# Altium schematic sheet Sheet6.SchDoc
size A2; PageSetup: Record=PageOptions|CenterHorizontal=True|CenterVertical=True|PrintScale=0.50|XCorrection=1.00|YCorrection=1.00|PrintKind=2|BorderSize=5000000|LeftOffset=0|BottomOffset=0|Orientation=2|PaperLength=1000|PaperWidth=1000|Scale=100|PaperSource=7|PrintQuality=-4|MediaType=1|DitherType=10|PaperKind=A4|PrintScaleMode=1
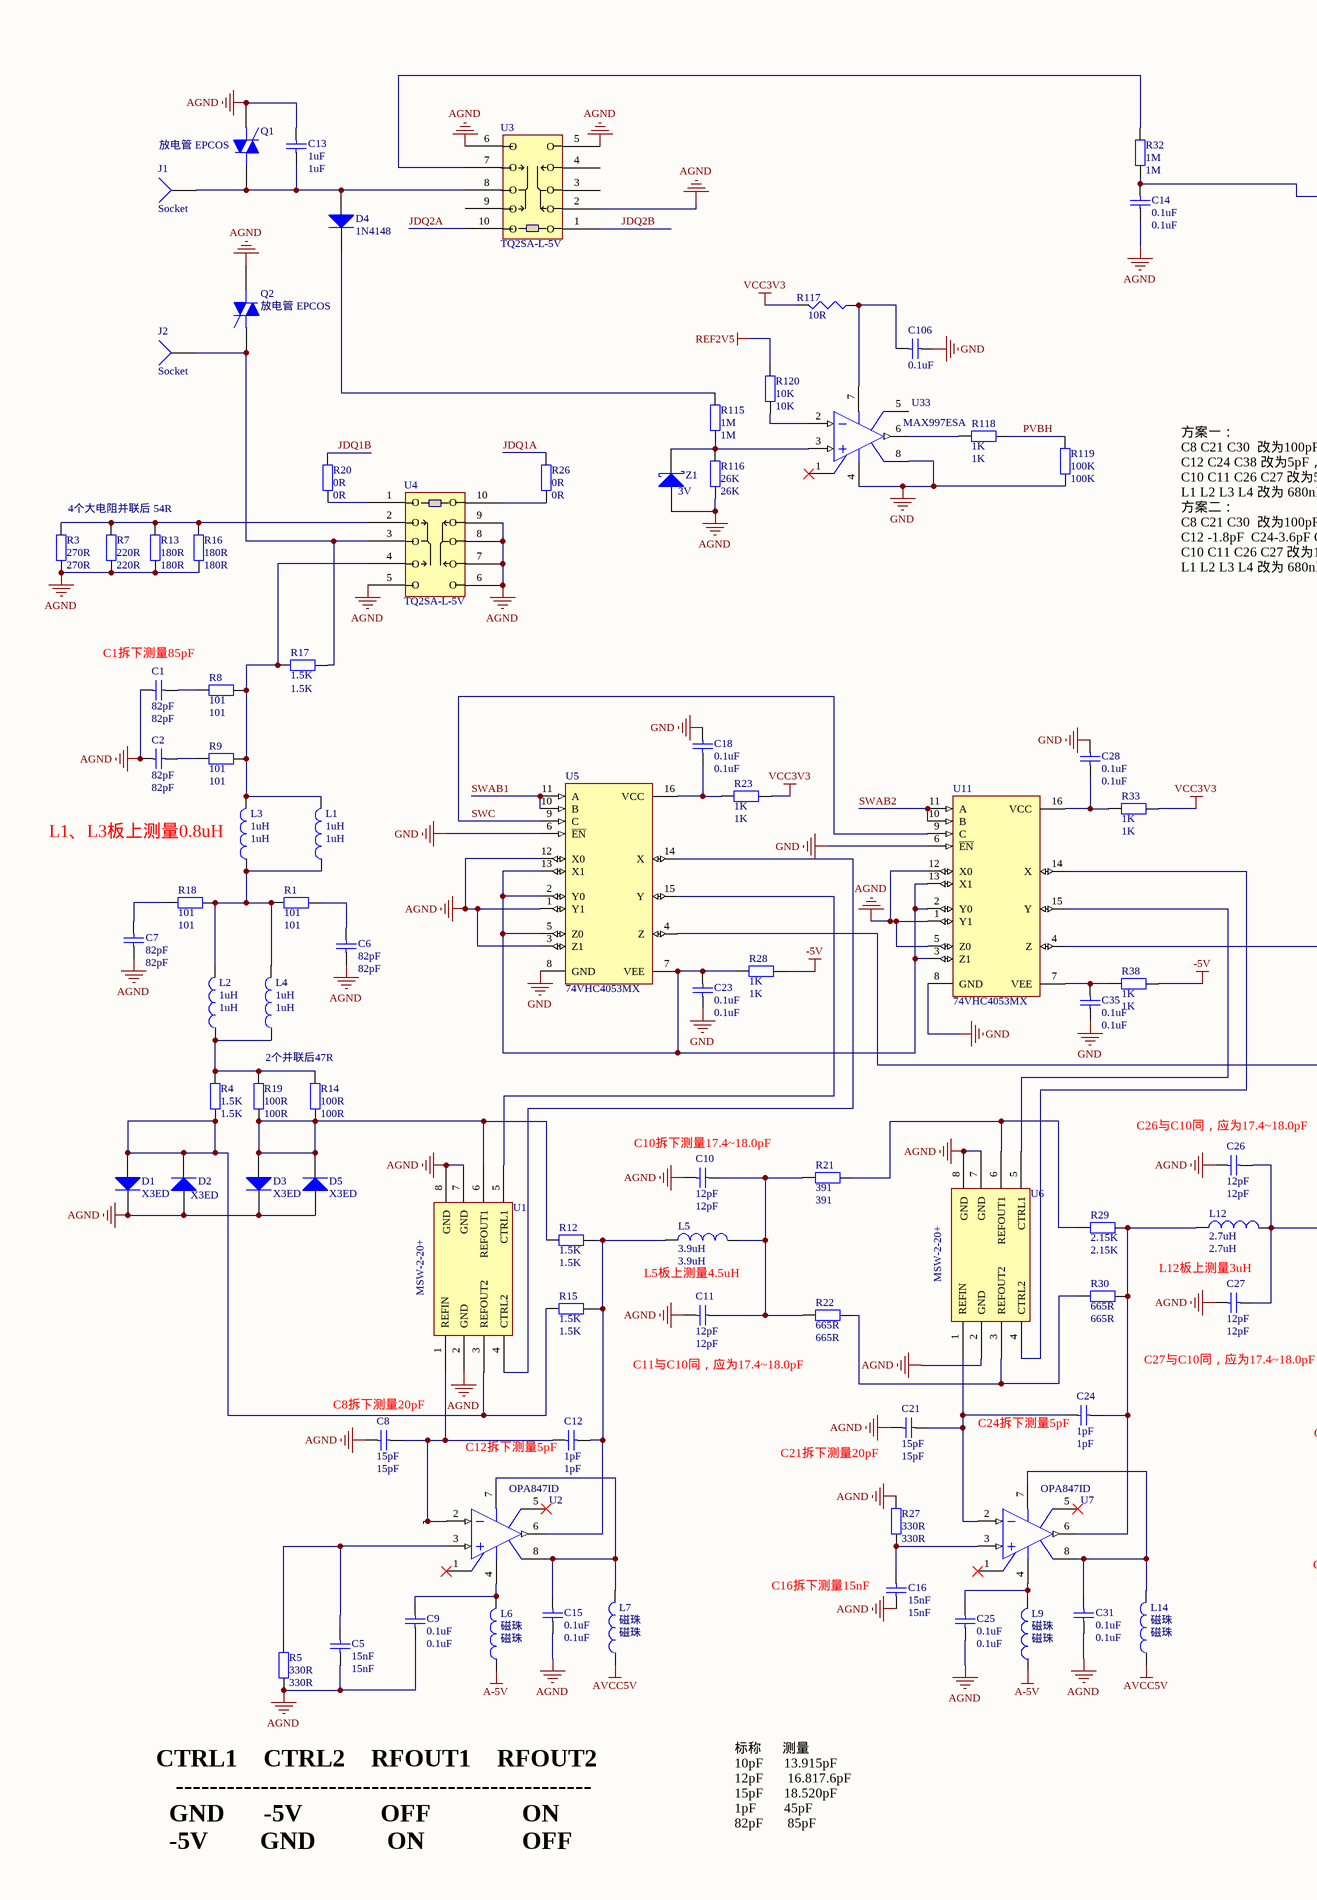
[diagram p0: Sheet6.SchDoc, left]
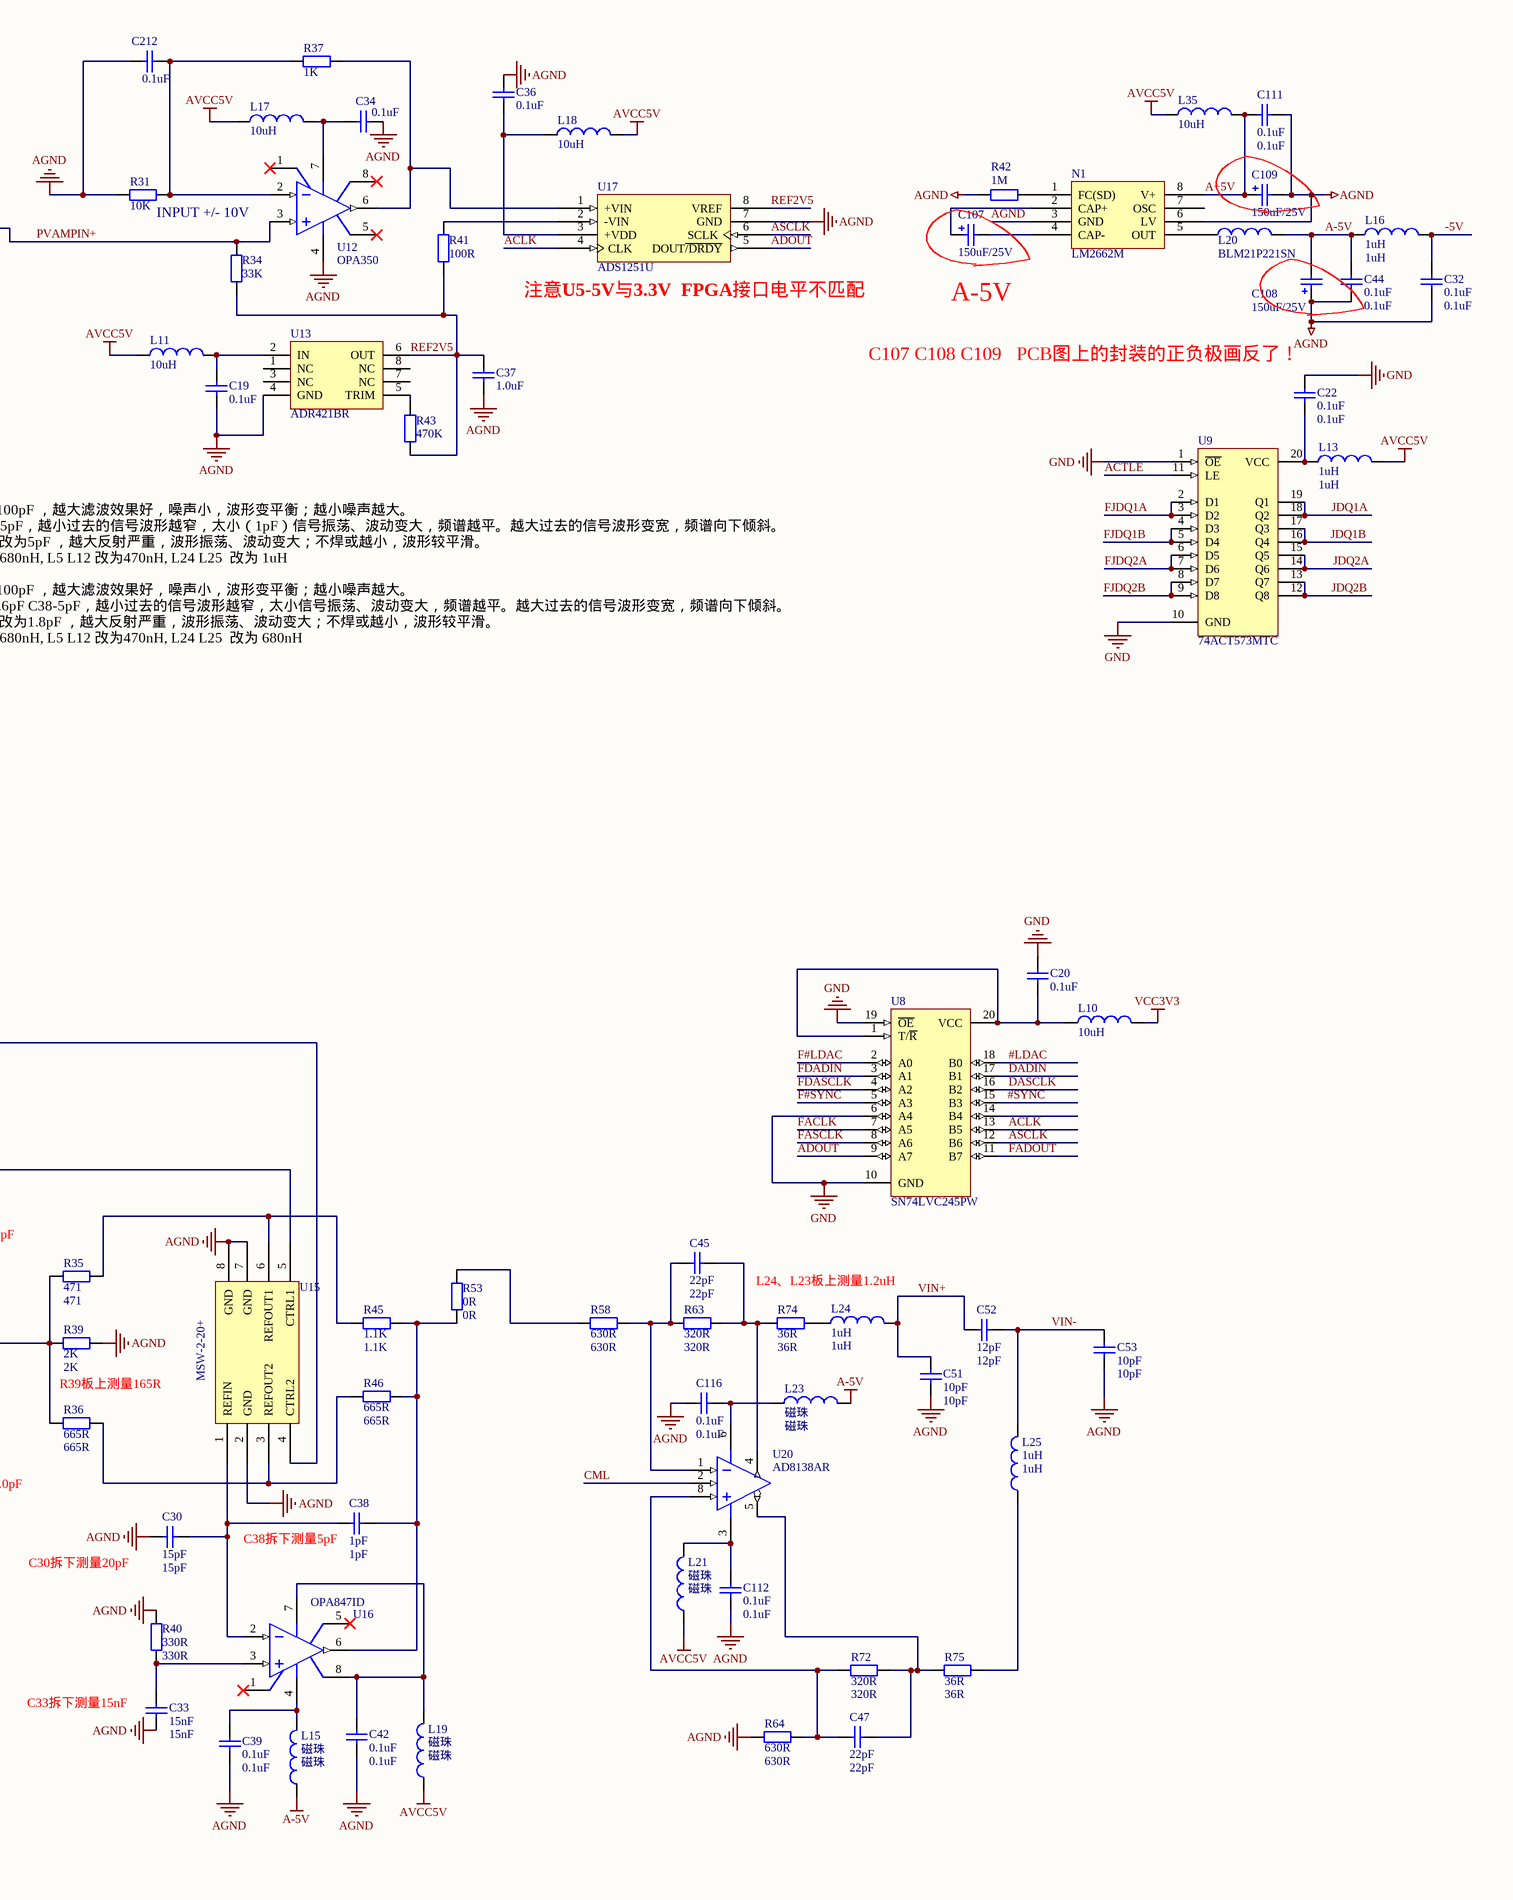
[diagram p1: Sheet6.SchDoc, right]

## Parts
C1  82pF  [1206C]
C2  82pF  [1206C]
C5  15nF  [0603C]
C6  82pF  [1206C]
C7  82pF  [1206C]
C8  15pF  [0603C]
C9  0.1uF  [0603C]
C10  12pF  [0603C]
C11  12pF  [0603C]
C12  1pF  [0603C]
C13  1uF  [RAD-0.2]
C14  0.1uF  [1206C]
C15  0.1uF  [0603C]
C16  15nF  [0603C]
C18  0.1uF  [0603C]
C19  0.1uF  [0603C]
C20  0.1uF  [0603C]
C21  15pF  [0603C]
C22  0.1uF  [0603C]
C23  0.1uF  [0603C]
C24  1pF  [0603C]
C25  0.1uF  [0603C]
C26  12pF  [0603C]
C27  12pF  [0603C]
C28  0.1uF  [0603C]
C30  15pF  [0603C]
C31  0.1uF  [0603C]
C32  0.1uF  [0603C]
C33  15nF  [0603C]
C34  0.1uF  [0603C]
C35  0.1uF  [0603C]
C36  0.1uF  [0603C]
C37  1.0uF  [0805C]
C38  1pF  [0603C]
C39  0.1uF  [0603C]
C42  0.1uF  [0603C]
C44  0.1uF  [0603C]
C45  22pF  [0603C]
C47  22pF  [0603C]
C51  10pF  [0603C]
C52  12pF  [0603C]
C53  10pF  [0603C]
C106  0.1uF  [0603C]
C107  150uF/25V  [SMC]
C108  150uF/25V  [SMC]
C109  150uF/25V  [SMC]
C111  0.1uF  [0603C]
C112  0.1uF  [0603C]
C116  0.1uF  [0603C]
C212  0.1uF  [0603C]
D1  X3ED  [L3583A]
D2  X3ED  [L3583A]
D3  X3ED  [L3583A]
D4  1N4148  [L3583A]
D5  X3ED  [L3583A]
J1  Socket  [PIN1]
J2  Socket  [PIN1]
L1  1uH  [1206L]
L2  1uH  [1206L]
L3  1uH  [1206L]
L4  1uH  [1206L]
L5  3.9uH  [1206L]
L6  磁珠  [6-0805_M]
L7  磁珠  [6-0805_M]
L9  磁珠  [6-0805_M]
L10  10uH  [6-0805_M]
L11  10uH  [1206L]
L12  2.7uH  [1206L]
L13  1uH  [6-0805_M]
L14  磁珠  [6-0805_M]
L15  磁珠  [6-0805_M]
L16  1uH  [6-0805_M]
L17  10uH  [1206L]
L18  10uH  [1206L]
L19  磁珠  [6-0805_M]
L20  BLM21P221SN  [6-0805_M]
L21  磁珠  [6-0805_M]
L23  磁珠  [6-0805_M]
L24  1uH  [1206L]
L25  1uH  [1206L]
L35  10uH  [1206L]
N1  LM2662M  [so_8]
Q1  放电管 EPCOS  [PIN-W2/E2.8]
Q2  放电管 EPCOS  [PIN-W2/E2.8]
R1  101  [1812]
R3  270R  [1812]
R4  1.5K  [1812]
R5  330R  [0603R]
R7  220R  [1812]
R8  101  [1812]
R9  101  [1812]
R12  1.5K  [0603R]
R13  180R  [1812]
R14  100R  [1812]
R15  1.5K  [0603R]
R16  180R  [1812]
R17  1.5K  [1812]
R18  101  [1812]
R19  100R  [1812]
R20  0R  [0603R]
R21  391  [0603R]
R22  665R  [0603R]
R23  1K  [0603R]
R26  0R  [0603R]
R27  330R  [0603R]
R28  1K  [0603R]
R29  2.15K  [0603R]
R30  665R  [0603R]
R31  10K  [0603R]
R32  1M  [0603R]
R33  1K  [0603R]
R34  33K  [0603R]
R35  471  [0603R]
R36  665R  [0603R]
R37  1K  [0603R]
R38  1K  [0603R]
R39  2K  [0603R]
R40  330R  [0603R]
R41  100R  [0603R]
R42  1M  [0603R]
R43  470K  [0603R]
R45  1.1K  [0603R]
R46  665R  [0603R]
R53  0R  [0603R]
R58  630R  [0603R]
R63  320R  [0603R]
R64  630R  [0603R]
R72  320R  [0603R]
R74  36R  [0603R]
R75  36R  [0603R]
R115  1M  [0603R]
R116  26K  [0603R]
R117  10R  [0603R]
R118  1K  [0603R]
R119  100K  [0603R]
R120  10K  [0603R]
U1  MSW-2-20+  [so_8]
U2  OPA847ID  [SMD8XX]
U3  TQ2SA-L-5V  [N10A]
U4  TQ2SA-L-5V  [N10A]
U5  74VHC4053MX  [M16A_N]
U6  MSW-2-20+  [so_8]
U7  OPA847ID  [SMD8XX]
U8  SN74LVC245PW  [NS020_N]
U9  74ACT573MTC  [MTC20_N]
U11  74VHC4053MX  [M16A_N]
U12  OPA350  [SMD8XX]
U13  ADR421BR  [SMD8XX]
U15  MSW-2-20+  [so_8]
U16  OPA847ID  [SMD8XX]
U17  ADS1251U
U20  AD8138AR  [SMD8XX]
U33  MAX997ESA  [SMD8XX]
Z1  3V  [425]

## Nets
-5V: C32.1 L16.2 R28.1 R38.1
A-5V: C44.1 C108.2 L6.1 L9.1 L15.1 L16.1 L20.2 L23.2
AGND: C1.2 C2.2 C5.2 C6.2 C7.2 C8.2 C9.2 C10.2 C11.2 C13.1 C14.1 C15.2 C16.2 C19.1 C21.2 C25.2 C26.2 C27.2 C30.2 C31.2 C32.2 C33.2 C34.1 C36.2 C37.1 C39.2 C42.2 C44.2 C51.2 C53.1 C108.1 C109.2 C111.1 C112.1 C116.2 C212.2 D1.2(K) D2.1(A) D3.2(K) D5.1(A) N1.3(GND) N1.6(LV) Q1.1(M1) Q2.2(M2) R3.1 R5.2 R7.1 R13.1 R16.1 R27.1 R31.1 R39.1 R40.1 R42.2 R64.2 R116.2 U1.2(GND) U1.7(GND) U1.8(GND) U3.2(O) U3.5(O) U3.6(O) U4.5(O) U4.6(O) U4.7(O) U4.8(O) U4.9(O) U5.1(Y1) U5.3(Z1) U5.12(X0) U6.2(GND) U6.7(GND) U6.8(GND) U11.1(Y1) U11.5(Z0) U11.12(X0) U12.4(V-) U13.4(GND) U15.2(GND) U15.7(GND) U15.8(GND) U17.7(GND) Z1.1(A)
AVCC5V: L7.1 L11.1 L13.2 L14.1 L17.1 L18.2 L19.1 L21.1 L35.1
GND: C18.1 C20.2 C22.2 C23.2 C28.1 C35.2 C106.2 R119.2 U5.6(~{EN}) U5.8(GND) U8.6(A4) U8.10(GND) U8.19(~{OE}) U9.1(~{OE}) U9.10(GND) U11.6(~{EN}) U11.8(GND) U33.4(V-) U33.8(EXT_CLKB)
REF2V5: C37.2 R34.1 R41.1 R43.1 R120.1 U13.6(OUT) U17.8(VREF)
VCC3V3: L10.2 R23.1 R33.1 R117.2
#LDAC: U8.18(B0)
#SYNC: U8.15(B3)
A+5V: C109.1 C111.2 L35.2 N1.8(V+)
ACLK: U8.13(B5) U17.4(CLK)
ACTLE: U9.11(LE)
ADOUT: U8.9(A7) U17.5(DOUT~{/DRDY})
ASCLK: U8.12(B6) U17.6(SCLK)
CML: U20.2(VOCM)
DADIN: U8.17(B1)
DASCLK: U8.16(B2)
F#LDAC: U8.2(A0)
F#SYNC: U8.5(A3)
FACLK: U8.7(A5)
FADOUT: U8.11(B7)
FASCLK: U8.8(A6)
FDADIN: U8.3(A1)
FDASCLK: U8.4(A2)
FJDQ1A: U9.2(D1) U9.3(D2)
FJDQ1B: U9.4(D3) U9.5(D4)
FJDQ2A: U9.6(D5) U9.7(D6)
FJDQ2B: U9.8(D7) U9.9(D8)
JDQ1A: R26.2 U9.18(Q2) U9.19(Q1)
JDQ1B: R20.1 U9.16(Q4) U9.17(Q3)
JDQ2A: U3.10(O) U9.14(Q6) U9.15(Q5)
JDQ2B: U3.1(O) U9.12(Q8) U9.13(Q7)
PVAMPIN+: C14.2 R32.2 R34.2 U12.3(IN+)
PVBH: R118.2 R119.1
SWAB1: U5.10(B) U5.11(A)
SWAB2: U11.10(B) U11.11(A)
SWC: U5.9(C) U11.9(C)
VIN+: C51.1 C52.1 L24.2
VIN-: C52.2 C53.2 L25.2
NetC1_1: C1.1 R8.2
NetC2_1: C2.1 R9.2
NetC5_1: C5.1 R5.1 U2.3(IN+)
NetC6_1: C6.1 R1.1
NetC7_1: C7.1 R18.2
NetC8_1: C8.1 C12.2 U1.1(REFIN) U2.2(IN-)
NetC9_1: C9.1 L6.2 U2.4(V-)
NetC10_1: C10.1 C11.1 L5.2 R21.2 R22.2
NetC12_1: C12.1 L5.1 R12.1 R15.1 U2.6(OUT)
NetC13_2: C13.2 D4.1(A) J1.1 Q1.2(M2) U3.8(O)
NetC15_1: C15.1 L7.2 U2.7(V+) U2.8(NULL2)
NetC16_1: C16.1 R27.2 U7.3(IN+)
NetC18_2: C18.2 R23.2 U5.16(VCC)
NetC19_2: C19.2 L11.2 U13.2(IN)
NetC20_1: C20.1 L10.1 U8.1(T/~{R}) U8.20(VCC)
NetC21_1: C21.1 C24.2 U6.1(REFIN) U7.2(IN-)
NetC22_1: C22.1 L13.1 U9.20(VCC)
NetC23_1: C23.1 R28.2 U5.2(Y0) U5.5(Z0) U5.7(VEE) U5.13(X1) U11.2(Y0) U11.3(Z1) U11.13(X1)
NetC24_1: C24.1 L12.1 R29.1 R30.1 U7.6(OUT)
NetC25_1: C25.1 L9.2 U7.4(V-)
NetC26_1: C26.1 C27.1 L12.2 R35.2 R36.2 R39.2
NetC28_2: C28.2 R33.2 U11.16(VCC)
NetC30_1: C30.1 C38.2 U15.1(REFIN) U16.2(IN-)
NetC31_1: C31.1 L14.2 U7.7(V+) U7.8(NULL2)
NetC33_1: C33.1 R40.2 U16.3(IN+)
NetC34_2: C34.2 L17.2 U12.7(V+)
NetC35_1: C35.1 R38.2 U11.7(VEE)
NetC36_1: C36.1 L18.1 U17.3(+VDD)
NetC38_1: C38.1 R45.1 R46.1 R53.2 U16.6(OUT)
NetC39_1: C39.1 L15.2 U16.4(V-)
NetC42_1: C42.1 L19.2 U16.7(V+) U16.8(NULL2)
NetC45_1: C45.1 R63.1 R74.2 U20.4(OUT+)
NetC45_2: C45.2 R58.1 R63.2 U20.1(IN-)
NetC47_1: C47.1 R64.1 R72.2 U20.8(IN+)
NetC47_2: C47.2 R72.1 R75.2 U20.5(OUT-)
NetC106_1: C106.1 R117.1 U33.7(V+)
NetC107_1: C107.1 N1.2(CAP+)
NetC107_2: C107.2 N1.4(CAP-)
NetC112_2: C112.2 L21.2 U20.3(V+)
NetC116_1: C116.1 L23.1 U20.6(V-)
NetC212_1: C212.1 R31.2 R37.1 U12.2(IN-)
NetD1_1: D1.1(A) D2.2(K) R4.1 R15.2 U1.3(REFOUT2)
NetD3_1: D3.1(A) D5.2(K) R12.2 R14.1 R19.1 U1.6(REFOUT1)
NetD4_2: D4.2(K) R115.1
NetJ2_1: J2.1 Q2.1(M1) R17.1 U4.3(O)
NetL1_1: L1.1 L2.2 L3.1 L4.2 R1.2 R18.1
NetL1_2: L1.2 L3.2 R8.1 R9.1 R17.2 U4.4(O)
NetL2_1: L2.1 L4.1 R4.2 R14.2 R19.2
NetL20_1: L20.1 N1.5(OUT)
NetL24_1: L24.1 R74.1
NetL25_1: L25.1 R75.1
NetN1_1: N1.1(FC(SD)) R42.1
NetR3_2: R3.2 R7.2 R13.2 R16.2 U4.2(O)
NetR20_2: R20.2 U4.1(O)
NetR21_1: R21.1 R29.2 U6.6(REFOUT1)
NetR22_1: R22.1 R30.2 U6.3(REFOUT2)
NetR26_1: R26.1 U4.10(O)
NetR32_1: R32.1 U3.7(O)
NetR35_1: R35.1 R45.2 U15.6(REFOUT1)
NetR36_1: R36.1 R46.2 U15.3(REFOUT2)
NetR37_2: R37.2 U12.6(OUT) U17.1(+VIN)
NetR41_2: R41.2 U17.2(-VIN)
NetR43_2: R43.2 U13.5(TRIM)
NetR53_1: R53.1 R58.2
NetR115_2: R115.2 R116.1 U33.3(IN+) Z1.2(K)
NetR118_1: R118.1 U33.6(OUT)
NetR120_2: R120.2 U33.2(IN-)
NetU1_4: U1.4(CTRL2) U5.14(X)
NetU1_5: U1.5(CTRL1) U5.15(Y)
NetU5_4: U5.4(Z) U15.5(CTRL1)
NetU6_4: U6.4(CTRL2) U11.14(X)
NetU6_5: U6.5(CTRL1) U11.15(Y)
NetU11_4: U11.4(Z) U15.4(CTRL2)

Not connected (* = marked no-connect by the designer): N1 7(OSC); U2 1(NULL1)* 5(NC)*; U3 3(O) 4(O) 9(O); U7 1(NULL1)* 5(NC)*; U8 14(B4); U12 1(VOSTRIM)* 5(NC)* 8(VOSTRIM)*; U13 1(NC) 3(NC) 7(NC) 8(NC); U16 1(NULL1)* 5(NC)*; U33 1(EXT_CLKA)* 5(RTN_CLK)

## Notes on the sheet
- (near R31) INPUT +/- 10V
- (near U17) 注意U5-5V与3.3V  FPGA接口电平不匹配
- (near C107) A-5V
- C107 C108 C109   PCB图上的封装的正负极画反了！
- 4个大电阻并联后 54R
- (near R43) 方案一：
  C8 C21 C30  改为100pF ，越大滤波效果好，噪声小，波形变平衡；越小噪声越大。
  C12 C24 C38 改为5pF，越小过去的信号波形越窄，太小（1pF）信号振荡、波动变大，频谱越平。越大过去的信号波形变宽，频谱向下倾斜。
  C10 C11 C26 C27 改为5pF ，越大反射严重，波形振荡、波动变大；不焊或越小，波形较平滑。
  L1 L2 L3 L4 改为 680nH, L5 L12 改为470nH, L24 L25  改为 1uH
  方案二：
  C8 C21 C30  改为100pF ，越大滤波效果好，噪声小，波形变平衡；越小噪声越大。
  C12 -1.8pF  C24-3.6pF C38-5pF，越小过去的信号波形越窄，太小信号振荡、波动变大，频谱越平。越大过去的信号波形变宽，频谱向下倾斜。
  C10 C11 C26 C27 改为1.8pF ，越大反射严重，波形振荡、波动变大；不焊或越小，波形较平滑。
  L1 L2 L3 L4 改为 680nH, L5 L12 改为470nH, L24 L25  改为 680nH
- (near C1) C1拆下测量85pF
- L1、L3板上测量0.8uH
- 2个并联后47R
- (near C26) C26与C10同，应为17.4~18.0pF
- (near C10) C10拆下测量17.4~18.0pF
- L24、L23板上测量1.2uH
- L5板上测量4.5uH
- L12板上测量3uH
- R39板上测量165R
- C11与C10同，应为17.4~18.0pF
- C27与C10同，应为17.4~18.0pF
- (near C8) C8拆下测量20pF
- C12拆下测量5pF
- (near C24) C24拆下测量5pF
- C30拆下测量20pF
- (near C38) C38拆下测量5pF
- C21拆下测量20pF
- C33拆下测量15nF
- C16拆下测量15nF
- CTRL1    CTRL2    RFOUT1    RFOUT2
  -------------------------------------------------
  GND      -5V            OFF              ON
  -5V        GND           ON               OFF
- 标称      测量
  10pF      13.915pF
  12pF       16.817.6pF
  15pF      18.520pF
  1pF        45pF
  82pF       85pF

## Library data of the parts
C1 C2 C5-C16 C18 C21-C28 C30-C33 C35 C38 C39 C42 C44 C45 C47 C51-C53 C106 C111 C112 C116 = Cap: Capacitor; Published: 8-Jun-2000; LatestRevisionDate: 17-Jul-2002; LatestRevisionNote: Re-released for DXP Platform.; PackageReference: RAD-0.3; Publisher: Altium Limited
  C1 C2 C6 C7: Value: 82pF
  C5 C16 C33: Value: 15nF
  C8 C21 C30: Value: 15pF
  C9 C14 C15 C18 C22 C23 C25 C28 C31 C32 C35 C39 C42 C44 C106 C111 C112 C116: Value: 0.1uF
  C10 C11 C26 C27 C52: Value: 12pF
  C12 C24 C38: Value: 1pF
  C13: Value: 1uF
  C45 C47: Value: 22pF
  C51 C53: Value: 10pF
C19 C20 C34 C36 C37 C212 = Cap Semi: Capacitor (Semiconductor SIM Model); Published: 8-Jun-2000; LatestRevisionDate: 29-May-2009; LatestRevisionNote: IPC-7351 Footprint Added.; PackageReference: C1206; Publisher: Altium Limited; PackageDescription: Chip Capacitor
  C19 C20 C34 C36 C212: Value: 0.1uF
  C37: Value: 1.0uF
C107-C109 = Capcitor polarity
D1-D5 = Diode: Default Diode; Published: 8-Jun-2000; LatestRevisionDate: 17-Jul-2002; LatestRevisionNote: Re-released for DXP Platform.; PackageVersion: Sep-1996; PackageReference: SMC; Publisher: Altium Limited; Code_JEDEC: DO-214-AB
L1-L7 L9-L19 L21 L23-L25 L35 = Inductor: Code_IEC: 1005; Published: 8-Jun-2000; LatestRevisionDate: 29-May-2009; LatestRevisionNote: IPC-7351 Footprint Added.; PackageReference: 0402-A; Publisher: Altium Limited; PackageDescription: Chip Inductor; Code_JEITA: 0402
  L1-L4 L13 L16 L24 L25: Value: 1uH
  L5: Value: 3.9uH
  L6 L7 L9 L14 L15 L19 L21 L23: Value: 磁珠
  L10 L11 L17 L18 L35: Value: 10uH
  L12: Value: 2.7uH
L20 = Inductor
N1 = LM2660
Q1 Q2 = Triac: Silicon Bidirectional Triode Thyristor; Note: Pin 2 is electrically connected to Pin 4 (TAB); Published: 29-Sep-2000; LatestRevisionDate: 17-Jul-2002; LatestRevisionNote: Re-released for DXP Platform.; DatasheetVersion: 1999; PackageReference: 369-03; Publisher: Altium Limited; Code_JEDEC: TO-251-AA; ComponentLink1Description: Manufacturer Link; ComponentLink1URL: http://www.motorola.com/
R1 R3-R5 R7-R9 R12-R23 R26-R41 R43 R45 R46 R53 R58 R63 R64 R72 R74 R75 R115 R116 R118-R120 = Res2: Resistor; Published: 8-Jun-2000; LatestRevisionDate: 17-Jul-2002; LatestRevisionNote: Re-released for DXP Platform.; PackageReference: AXIAL-0.4; Publisher: Altium Limited
  R1 R8 R9 R18: Value: 101
  R3: Value: 270R
  R4 R12 R15 R17: Value: 1.5K
  R5 R27 R40: Value: 330R
  R7: Value: 220R
  R13 R16: Value: 180R
  R14 R19 R41: Value: 100R
  R20 R26 R53: Value: 0R
  R21: Value: 391
  R22 R30 R36 R46: Value: 665R
  R23 R28 R33 R37 R38 R118: Value: 1K
  R29: Value: 2.15K
  R31 R120: Value: 10K
  R32 R115: Value: 1M
  R34: Value: 33K
  R35: Value: 471
  R39: Value: 2K
  R43: Value: 470K
  R45: Value: 1.1K
  R58 R64: Value: 630R
  R63 R72: Value: 320R
  R74 R75: Value: 36R
  R116: Value: 26K
  R119: Value: 100K
R42 = Resistor
R117 = Res3: Resistor; Published: 8-Jun-2000; LatestRevisionDate: 29-May-2009; LatestRevisionNote: IPC-7351 Footprint Added.; PackageReference: J1-0603; Publisher: Altium Limited; PackageDescription: Chip Resistor; Value: 10R
U1 U6 U15 = MCL MSW-2
U2 U7 U16 = AD847AQ: High-Speed, Low-Power Monolithic Operational Amplifier; Note: Pin 5 is not connected.; Published: 8-Jun-2000; LatestRevisionDate: 04-Mar-2005; LatestRevisionNote: Stylized 3D Model Added.; DatasheetVersion: REV. F; PackageVersion: 1998; PackageReference: Q-8; Publisher: Altium Limited; PackageDescription: DIP; 8 Leads; Row Spacing 7.62 mm; Pitch 2.54 mm; ComponentLink1Description: Manufacturer Link; ComponentLink1URL: http://www.analog.com/en/prod/0%2C2877%2CAD847%2C00.html; ComponentLink2Description: Datasheet; ComponentLink2URL: http://www.analog.com/UploadedFiles/Data_Sheets/261800323ad847.pdf
U3 U4 = TQ2SA
U5 U11 = 74VHC4053M: Triple 2-Channnel Analog Multiplexer; Published: 17-Jul-2002; LatestRevisionDate: 13-Apr-2006; LatestRevisionNote: IPC-7351 Footprint Added.; DatasheetVersion: Apr-1999; PackageVersion: 2000; PackageReference: M16A; Publisher: Altium Limited; PackageDescription: 16-Pin Small Outline Integrated Circuit 1.27 mm Pitch; Code_IPC: SOIC127P600-16; ComponentLink1Description: Manufacturer Link; ComponentLink1URL: http://www.fairchildsemi.com/; ComponentLink2Description: Datasheet; ComponentLink2URL: http://www.fairchildsemi.com/ds/74%2F74VHC4051.pdf
U8 = SN74LVC245PW: Octal Bus Transceiver with 3-State Outputs; ComponentAvailability: Obsolete; Published: 8-Jun-2000; LatestRevisionDate: 04-Mar-2005; LatestRevisionNote: Stylized 3D Model Added.; DatasheetVersion: Jul-1994; PackageVersion: Feb-1999; PackageReference: PW020; Publisher: Altium Limited; PackageDescription: Shrink Small Outline; 20 Leads; Body Width 4.4 mm; Pitch 0.65 mm; ComponentLink1Description: Manufacturer Link; ComponentLink1URL: http://www.ti.com/; ComponentLink2Description: URL Link1; ComponentLink2URL: http://focus.ti.com/docs/prod/folders/print/sn74lvc245.html
U9 = 74ACT573MTC: Octal Latch with 3-State Output; Published: 17-Jul-2002; LatestRevisionDate: 29-May-2009; LatestRevisionNote: IPC-7351 Footprint Added.; DatasheetVersion: Oct-1999; PackageVersion: 2000; PackageReference: MTC20; Publisher: Altium Limited; PackageDescription: 20-Pin Thin Small Outline Package 0.65 mm Pitch; ComponentLink1Description: Manufacturer Link; ComponentLink1URL: http://www.fairchildsemi.com/; ComponentLink2Description: Datasheet; ComponentLink2URL: http://www.fairchildsemi.com/ds/74%2F74ACT573.pdf
U12 = OP07AJ: Ultra-Low Offset Voltage Operational Amplifier; Note: Pin 5 is not connected.; Published: 8-Jun-2000; LatestRevisionDate: 17-Jul-2002; LatestRevisionNote: Re-released for DXP Platform.; DatasheetVersion: 1992; PackageVersion: 1990; PackageReference: H-08A; Publisher: Altium Limited; PackageDescription: Can; 8 Leads; Pin Circle Dia. 5.08 mm; Lead Dia. 0.53 mm (max); ComponentLink1Description: Manufacturer Link; ComponentLink1URL: http://www.analog.com/en/prod/0,,759_786_OP07%2C00.html; ComponentLink2Description: Datasheet; ComponentLink2URL: http://www.analog.com/UploadedFiles/Data_Sheets/39161232478959OP07_c.pdf
U13 = REF01AJ: +10V Precision Voltage Reference; Note: Pins 1, 3, 7 and 8 are not connected; Pin 4 is connected to case; Published: 8-Jun-2000; LatestRevisionDate: 17-Jul-2002; LatestRevisionNote: Re-released for DXP Platform.; DatasheetVersion: REV. B 1992; PackageVersion: 1990; PackageReference: H-08A; Publisher: Altium Limited; PackageDescription: Can; 8 Leads; Pin Circle Dia. 5.08 mm; Lead Dia. 0.53 mm (max); ComponentLink1Description: Manufacturer Link; ComponentLink1URL: http://www.analog.com/en/prod/0%2C2877%2CREF01%2C00.html; ComponentLink2Description: Datasheet; ComponentLink2URL: http://www.analog.com/UploadedFiles/Data_Sheets/400769540REF01_g.pdf
U17 = ads1251
U20 = AD8138
U33 = ICL7650BCSA-1: Chopper Stabilized Operational Amplifier; Published: 16-Jan-2001; LatestRevisionDate: 13-Apr-2006; LatestRevisionNote: IPC-7351 Footprint Added.; DatasheetVersion: Aug-1996; PackageReference: NSO8; Publisher: Altium Limited; PackageDescription: 8-Pin Small Outline Integrated Circuit 1.27 mm Pitch; Code_JEDEC: MS-012-AA; Code_IPC: SOIC127P600-8; ComponentLink1Description: Manufacturer Link; ComponentLink1URL: http://www.maxim-ic.com/; ComponentLink2Description: Datasheet; ComponentLink2URL: http://pdfserv.maxim-ic.com/en/ds/ICL7650-ICL7650B.pdf
Z1 = Diode_type1
J1 J2 = Socket: LatestRevisionDate: 17-Jul-2002; LatestRevisionNote: Re-released for DXP Platform.; Publisher: Altium Limited